# EAGLE schematic potenciostato_last (EAGLE 9.3.0)
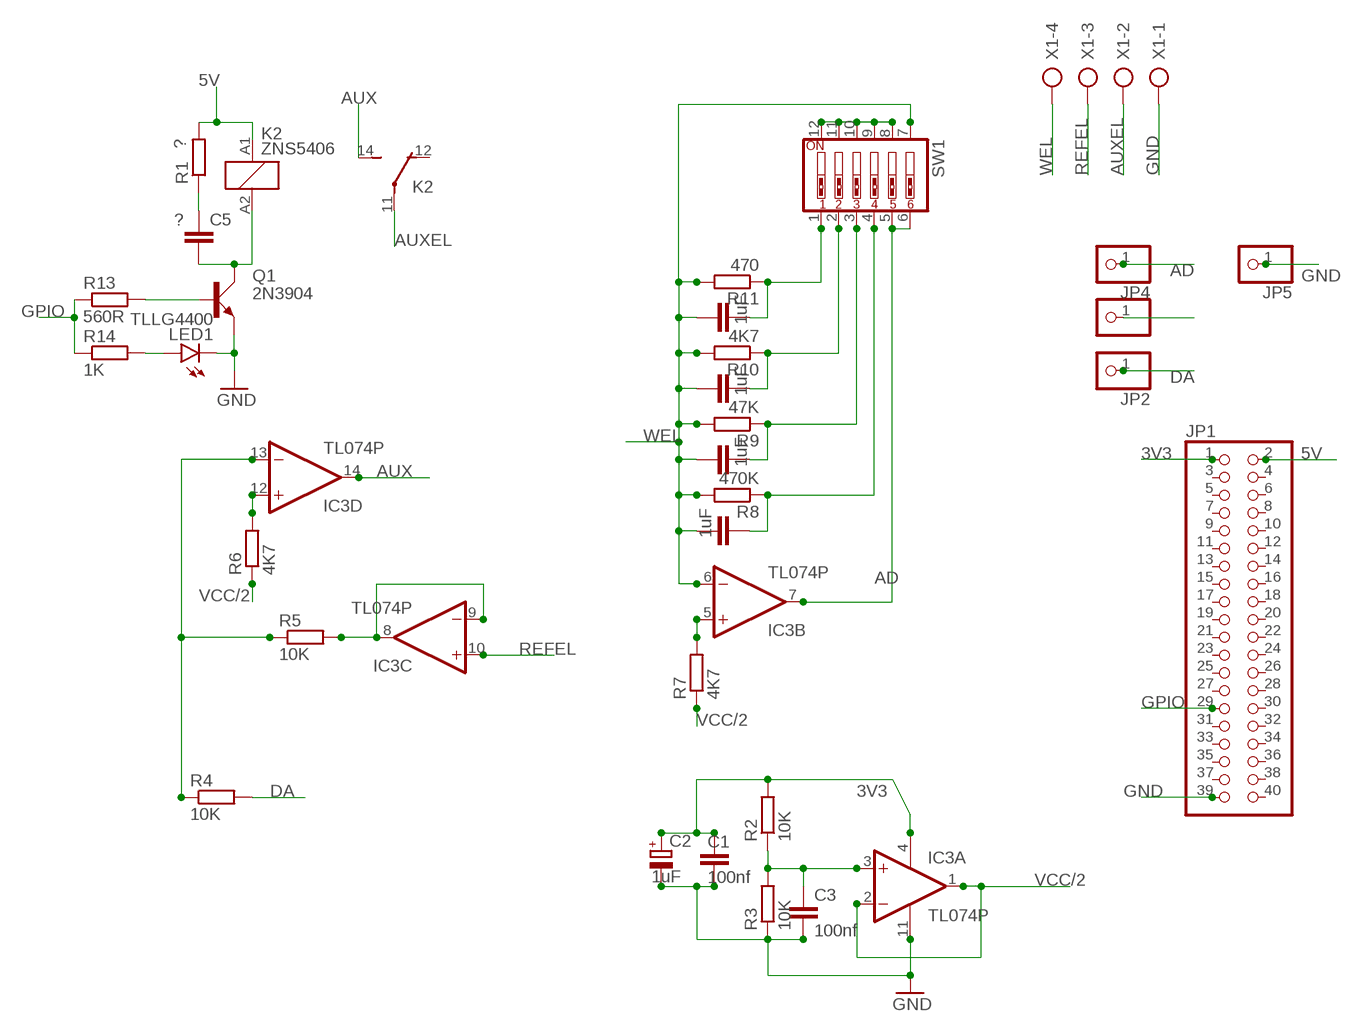
[diagram p0: schematic, sheet 1]

## Parts
C1  100nf  C-EU050-035X075  [C050-035X075]
C2  1uF  CPOL-EUE2.5-5  [E2,5-5]
C3  100nf  C-EU050-035X075  [C050-035X075]
C4  1uF  C-EU050-035X075  [C050-035X075]
C5  ?  C-EU050-035X075  [C050-035X075]
C6  1uF  C-EU050-035X075  [C050-035X075]
C7  1uF  C-EU050-035X075  [C050-035X075]
C8  1uF  C-EU050-035X075  [C050-035X075]
IC3  TL074P  [DIL14]
JP1  PINHD-2X20/90  [2X20/90]
JP2  PINHD-1X1  [1X01]
JP3  PINHD-1X1  [1X01]
JP4  PINHD-1X1  [1X01]
JP5  PINHD-1X1  [1X01]
K2  ZNS5406  [ZN5]
LED1  TLLG4400  [LED3MM]
Q1  2N3904  [TO92D]
R1  ?  R-EU_0207/7  [0207/7]
R2  10K  R-EU_0207/7  [0207/7]
R3  10K  R-EU_0207/7  [0207/7]
R4  10K  R-EU_0207/7  [0207/7]
R5  10K  R-EU_0207/7  [0207/7]
R6  4K7  R-EU_0207/7  [0207/7]
R7  4K7  R-EU_0207/7  [0207/7]
R8  470K  R-EU_0207/7  [0207/7]
R9  47K  R-EU_0207/7  [0207/7]
R10  4K7  R-EU_0207/7  [0207/7]
R11  470  R-EU_0207/7  [0207/7]
R13  560R  R-EU_0207/7  [0207/7]
R14  1K  R-EU_0207/7  [0207/7]
SW1  SW_DIP-6  [EDG-06]
X1  AK500/4  [AK500/4]

## Nets
3V3: C1.1 C2.+ IC3.4(P:V+) JP1.1 R2.2
5V: JP1.2 K2.A1 R1.2
AD: IC3.7(B:OUT) JP4.1 SW1.5 SW1.6
AUX: IC3.14(D:OUT) K2.14(2:S)
AUXEL: K2.11(2:P) X1.2
DA: JP2.1 R4.2
GND: C1.2 C2.- C3.2 IC3.11(P:V-) JP1.39 JP5.1 LED1.K(C) Q1.E R3.1 X1.1
GPIO: JP1.29 R13.1 R14.1
N$1: C4.2 R8.1 SW1.4
N$2: IC3.8(C:OUT) IC3.9(C:-IN) R5.2
N$3: C3.1 IC3.3(A:+IN) R2.1 R3.2
N$4: IC3.13(D:-IN) R4.1 R5.1
N$5: C5.1 R1.1
N$6: IC3.12(D:+IN) R6.2
N$7: JP3.1
N$8: IC3.5(B:+IN) R7.2
N$9: SW1.8 SW1.9 SW1.10 SW1.11 SW1.12
N$10: C6.2 R11.1 SW1.1
N$11: C7.2 R10.1 SW1.2
N$12: C8.2 R9.1 SW1.3
N$15: C5.2 K2.A2 Q1.C
N$16: LED1.A R14.2
N$18: Q1.B R13.2
REFEL: IC3.10(C:+IN) X1.3
VCC/2: IC3.1(A:OUT) IC3.2(A:-IN) R6.1 R7.1
WEL: C4.1 C6.1 C7.1 C8.1 IC3.6(B:-IN) R8.2 R9.2 R10.2 R11.2 SW1.7 X1.4
Unconnected: JP1.3 JP1.4 JP1.5 JP1.6 JP1.7 JP1.8 JP1.9 JP1.10 JP1.11 JP1.12 JP1.13 JP1.14 JP1.15 JP1.16 JP1.17 JP1.18 JP1.19 JP1.20 JP1.21 JP1.22 JP1.23 JP1.24 JP1.25 JP1.26 JP1.27 JP1.28 JP1.30 JP1.31 JP1.32 JP1.33 JP1.34 JP1.35 JP1.36 JP1.37 JP1.38 JP1.40 K2.12(2:O)

## Library data of the parts
C1 C3-C8 = rcl:C-EU: CAPACITOR, European symbol; SPICEPREFIX: C
C2 = rcl:CPOL-EU: POLARIZED CAPACITOR, European symbol; SPICEPREFIX: C
IC3 = linear:TL074: OP AMP
JP1 = pinhead:PINHD-2X20: PIN HEADER
JP2-JP5 = pinhead:PINHD-1X1: PIN HEADER
K2 = relay:ZNS5*: Miniature Power PCB Relay SCHRACK 1pole 10 A Source: http://www.schrack.com/.. 5847.pdf; OC_FARNELL: unknown; OC_NEWARK: unknown
LED1 = led:TLLG4400: Low Current (2mA) LED 3 mm Tinted Diffused Package color GREEN Source: Data sheet <http://www.farnell.com/datasheets/391098.pdf>; MF: VISHAY SEMICONDUCTOR; OC_FARNELL: 1612435
Q1 = transistor-small-signal:2N3904: NPN TRANSISTOR
R1-R11 R13 R14 = rcl:R-EU_: RESISTOR, European symbol; SPICEPREFIX: R
SW1 = special:SW_DIP-6: DIP SWITCH
X1 = con-ptr500:AK500/4: CONNECTOR; OC_FARNELL: unknown; OC_NEWARK: unknown